# EAGLE design breakout_motor_driver (EAGLE 7.5.0)
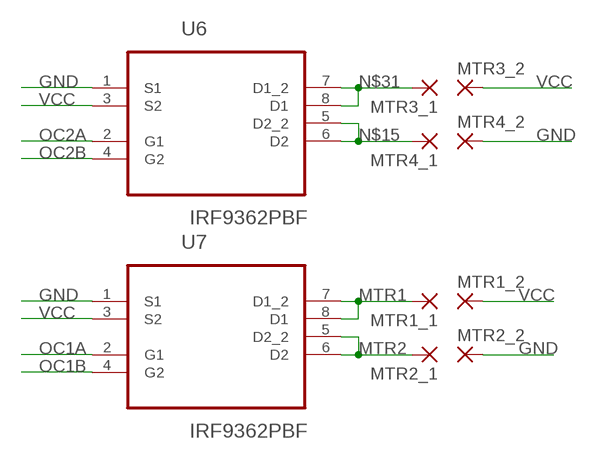
[diagram p0: schematic, sheet 1]

## Parts
MTR1_1  1,6/0,8  [1,6/0,8]
MTR1_2  1,6/0,8  [1,6/0,8]
MTR2_1  1,6/0,8  [1,6/0,8]
MTR2_2  1,6/0,8  [1,6/0,8]
MTR3_1  1,6/0,8  [1,6/0,8]
MTR3_2  1,6/0,8  [1,6/0,8]
MTR4_1  1,6/0,8  [1,6/0,8]
MTR4_2  1,6/0,8  [1,6/0,8]
U6  IRF9362PBF  [SOIC127P600X175-8N]
U7  IRF9362PBF  [SOIC127P600X175-8N]

## Nets
GND: MTR2_2.1(P) MTR4_2.1(P) U6.1(S1) U7.1(S1)
MTR1: MTR1_1.1(P) U7.7(D1_2) U7.8(D1)
MTR2: MTR2_1.1(P) U7.5(D2_2) U7.6(D2)
N$15: MTR4_1.1(P) U6.5(D2_2) U6.6(D2)
N$31: MTR3_1.1(P) U6.7(D1_2) U6.8(D1)
OC1A: U7.2(G1)
OC1B: U7.4(G2)
OC2A: U6.2(G1)
OC2B: U6.4(G2)
VCC: MTR1_2.1(P) MTR3_2.1(P) U6.3(S2) U7.3(S2)

## Library data of the parts
MTR1_1 MTR1_2 MTR2_1 MTR2_2 MTR3_1 MTR3_2 MTR4_1 MTR4_2 = wirepad:1,6/0,8: THROUGH-HOLE PAD
U6 U7 = International_Rectifier_By_element14_Batch_1:IRF9362PBF: HEXFET Power MOSFET; MPN: IRF9362PBF; OC_FARNELL: 1857301; OC_NEWARK: 79R7563; PACKAGE: SOIC-8; SUPPLIER: INTERNATIONAL RECTIFIER

## Net classes
0 default: clearance 0.205 mm

## Board
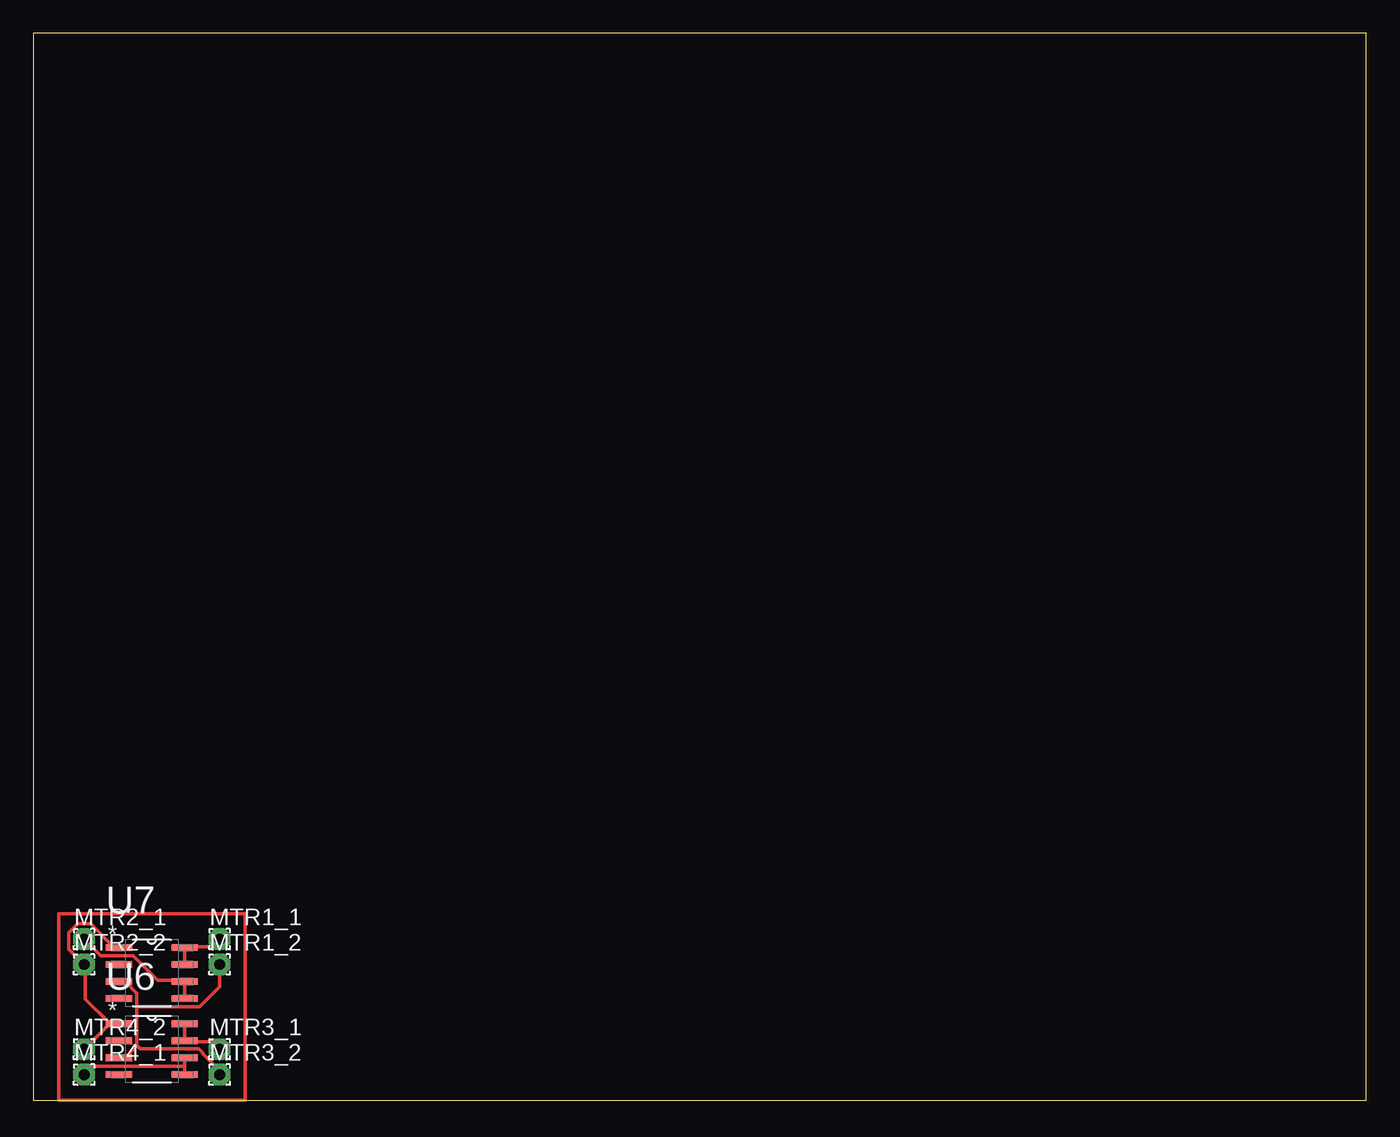
[diagram p1: board, top side]

Size 100 x 80 mm. Coordinates in mm from the lower left corner, seen from the top.
Outline: 0,0 100,0 100,80 0,80 0,0
Copper layers (1*16): Top 0.035mm / dielectric 1.5mm / Bottom 0.035mm
Design rules "default": minimum track width 10mil, minimum drill 24mil, track to track 8mil, track to pad 8mil, pad to pad 8mil, via to via 8mil, smd to smd 8mil, copper to edge 40mil, drill to drill 8mil, minimum pad ring 10mil, minimum via ring 8mil, stop-mask expansion 4mil, vias tented up to drill 0mil, thermal gap 10mil

### Footprints (pad centres in the part's own frame; a part is rotated, then mirrored left to right if it is on the bottom)
1,6/0,8 = drill 0.813 pad 1.6 octagon: 1 0,0
SOIC127P600X175-8N = smd 1.981 x 0.508: 1 -2.464,1.905; 2 -2.464,0.635; 3 -2.464,-0.635; 4 -2.464,-1.905; 5 2.464,-1.905; 6 2.464,-0.635; 7 2.464,0.635; 8 2.464,1.905

### Placement (x,y rotation side)
MTR1_1  13.97,12.06 0 top
MTR1_2  13.97,10.16 0 top
MTR2_1  3.81,12.06 0 top
MTR2_2  3.81,10.16 0 top
MTR3_1  13.97,3.81 0 top
MTR3_2  13.97,1.91 0 top
MTR4_1  3.81,1.91 0 top
MTR4_2  3.81,3.81 0 top
U6  8.89,3.81 0 top
U7  8.89,9.53 0 top

### Tracks (layer width: path | path; a pad name or v marks a point on that pad's centre or on a via)
GND
  Top 0.254: U7.1 6.07,11.43 4.29,13.21 3.33,13.21 2.67,12.55 2.67,11.3 MTR2_2.1 3.89,10.06 3.89,7.57 5.64,5.82 U6.1 5.71,5.71 MTR4_2.1
MTR1
  Top 0.254: U7.7 U7.8 11.46,11.51 13.41,11.51 MTR1_1.1
MTR2
  Top 0.254: U7.5 U7.6 11.25,8.97 9.35,8.97 7.49,10.82 5.05,10.82 MTR2_1.1
N$1
  Top 0.254: 1.91,13.97 1.91,0 15.88,0 15.88,13.97 1.91,13.97
N$15
  Top 0.254: U6.6 11.35,2.52 | 11.35,2.52 U6.5 | 11.35,2.52 4.42,2.52 MTR4_1.1
N$31
  Top 0.254: U6.8 U6.7 11.46,4.37 13.41,4.37 MTR3_1.1
VCC
  Top 0.254: U6.3 6.88,3.17 7.77,4.06 | 7.77,7.01 7.77,8 6.88,8.89 U7.3 | 7.77,7.01 7.77,4.06 | MTR3_2.1 13.97,2.18 12.7,3.45 12.7,3.56 12.42,3.83 8.03,3.83 7.87,3.99 7.77,4.06 | MTR1_2.1 13.97,8.51 12.47,7.01 7.77,7.01